# Altium schematic sheet MontageScheme.SchDoc
size A3; SheetNumber: 1; SheetTotal: 1
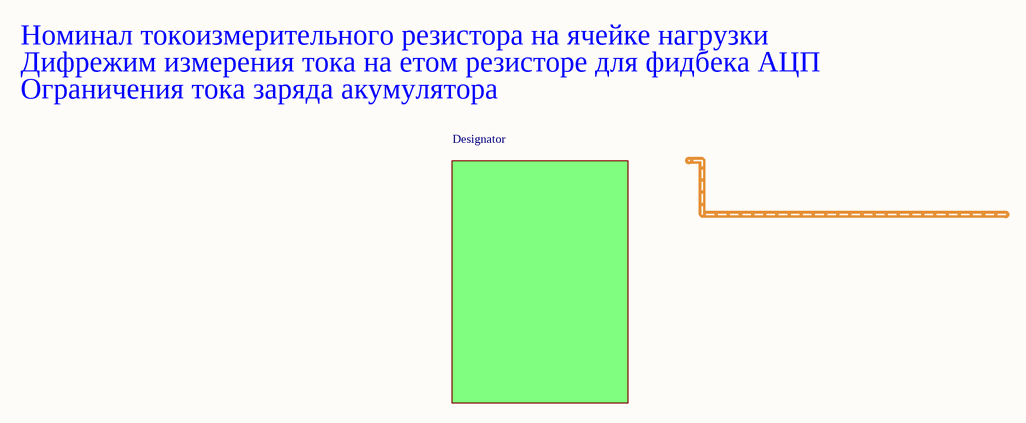
[diagram p0: MontageScheme.SchDoc]

## Sub-sheets
Designator = ?: no entries

## Notes on the sheet
- Номинал токоизмерительного резистора на ячейке нагрузки
- Дифрежим измерения тока на етом резисторе для фидбека АЦП
- Ограничения тока заряда акумулятора